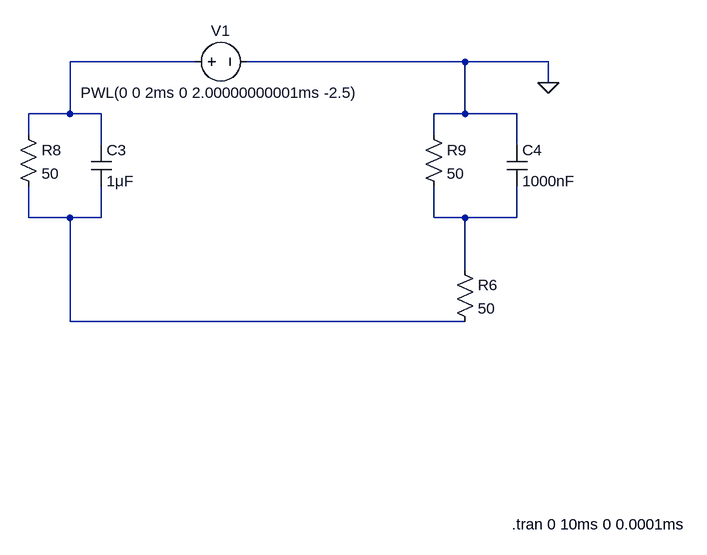
[diagram p0: schematic 電圧刺激等価回路_2compartment_tmp.asc]
電圧刺激等価回路_2compartment_tmp.asc, the LTspice schematic file:
Version 4
SHEET 1 1116 680
WIRE 320 -368 128 -368
WIRE 736 -368 400 -368
WIRE 864 -368 736 -368
WIRE 864 -336 864 -368
WIRE 128 -288 128 -368
WIRE 128 -288 64 -288
WIRE 176 -288 128 -288
WIRE 736 -288 736 -368
WIRE 736 -288 688 -288
WIRE 816 -288 736 -288
WIRE 64 -256 64 -288
WIRE 688 -256 688 -288
WIRE 176 -240 176 -288
WIRE 816 -240 816 -288
WIRE 64 -128 64 -176
WIRE 128 -128 64 -128
WIRE 176 -128 176 -176
WIRE 176 -128 128 -128
WIRE 688 -128 688 -176
WIRE 736 -128 688 -128
WIRE 816 -128 816 -176
WIRE 816 -128 736 -128
WIRE 736 -48 736 -128
WIRE 128 32 128 -128
WIRE 736 32 128 32
FLAG 864 -336 0
SYMBOL res 720 -64 R0
SYMATTR InstName R6
SYMATTR Value 50
SYMBOL cap 160 -240 R0
SYMATTR InstName C3
SYMATTR Value 1μF
SYMBOL cap 800 -240 R0
SYMATTR InstName C4
SYMATTR Value 1000nF
SYMBOL res 48 -272 R0
SYMATTR InstName R8
SYMATTR Value 50
SYMBOL res 672 -272 R0
SYMATTR InstName R9
SYMATTR Value 50
SYMBOL voltage 304 -368 R270
WINDOW 0 32 56 VTop 2
WINDOW 3 -32 56 VBottom 2
WINDOW 123 0 0 Left 0
WINDOW 39 0 0 Left 0
SYMATTR InstName V1
SYMATTR Value PWL(0 0 2ms 0 2.00000000001ms -2.5)
TEXT 808 344 Left 2 !.tran 0 10ms 0 0.0001ms

The netlist it stands for:
* 電圧刺激等価回路_2compartment_tmp.asc
R6 N003 N002 50
C3 N001 N002 1μF
C4 0 N003 1000nF
R8 N001 N002 50
R9 0 N003 50
V1 N001 0 PWL(0 0 2ms 0 2.00000000001ms -2.5)
.tran 0 10ms 0 0.0001ms
.backanno
.end